# Altium schematic sheet My_robot_1.SchDoc
size A
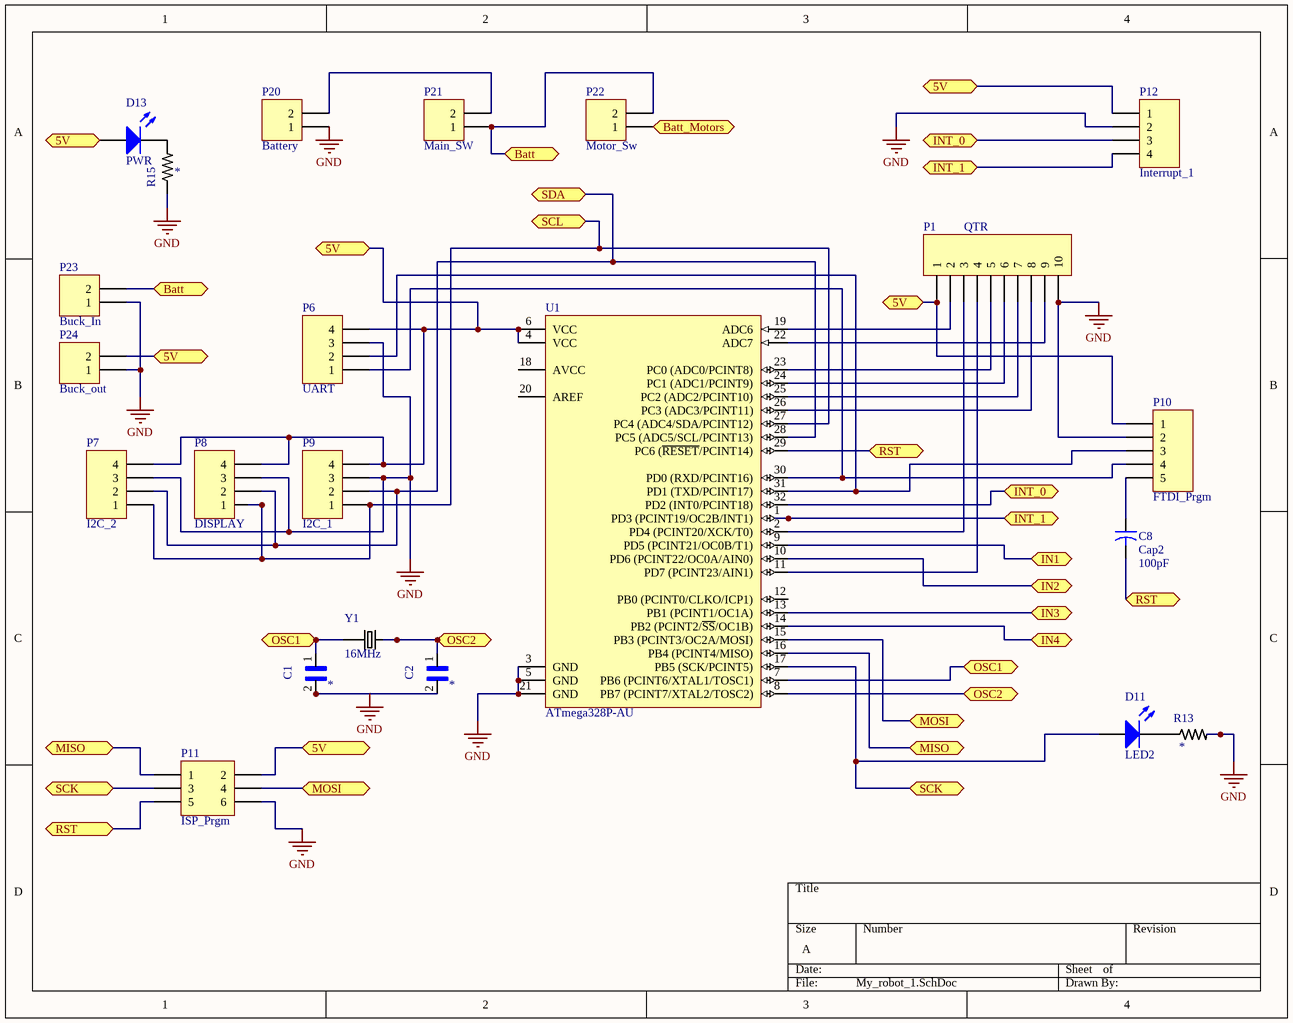
[diagram p0: My_robot_1.SchDoc]

## Parts
C1  Cap_0805  [CAP_0805]  (value not drawn)
C2  Cap_0805  [CAP_0805]  (value not drawn)
C8  Cap2  value 100pF  [CAPR5-4X5]
D11  LED2  [3.2X1.6X1.1]
D13  PWR  [3.2X1.6X1.1]
P1  QTR  [HDR1X10]
P6  UART  [HDR1X4]
P7  I2C_2  [HDR1X4]
P8  DISPLAY  [HDR1X4]
P9  I2C_1  [HDR1X4]
P10  FTDI_Prgm  [HDR1X5]
P11  ISP_Prgm  [HDR2X3]
P12  Interrupt_1  [HDR1X4]
P20  Battery  [HDR1X2]
P21  Main_SW  [HDR1X2]
P22  Motor_Sw  [HDR1X2]
P23  Buck_In  [HDR1X2]
P24  Buck_out  [HDR1X2]
R13  Res_0805  [Res_0805]  (value not drawn)
R15  Res_0805  [Res_0805]  (value not drawn)
U1  ATmega328P-AU  [32A_N]
Y1  16MHz  [XTAL_THT]

## Ports
5V, Batt, Batt_Motors, IN1, IN2, IN3, IN4, INT_0, INT_1, MISO, MOSI, OSC1, OSC2, RST, SCK, SCL, SDA

## Nets
GND: C1.2 C2.2 P1.10 P6.3 P7.3 P8.3 P9.3 P10.2 P11.6 P12.2 P20.1 P23.1 P24.1 R13.2 R15.1 U1.3(GND) U1.5(GND) U1.21(GND)
5V: D13.1(A) P1.1 P6.4 P7.4 P8.4 P9.4 P10.1 P11.2 P12.1 P24.2 U1.4(VCC) U1.6(VCC) ; port 5V
Batt: P21.1 P22.2 P23.2 ; port Batt
Batt_Motors: P22.1 ; port Batt_Motors
IN1: U1.9(PD5_(PCINT21/OC0B/T1)) ; port IN1
IN2: U1.10(PD6_(PCINT22/OC0A/AIN0)) ; port IN2
IN3: U1.13(PB1_(PCINT1/OC1A)) ; port IN3
IN4: U1.14(PB2_(PCINT2/~{SS}/OC1B)) ; port IN4
INT_0: P12.3 U1.32(PD2_(INT0/PCINT18)) ; port INT_0
INT_1: P12.4 U1.1(PD3_(PCINT19/OC2B/INT1)) ; port INT_1
MISO: P11.1 U1.16(PB4_(PCINT4/MISO)) ; port MISO
MOSI: P11.4 U1.15(PB3_(PCINT3/OC2A/MOSI)) ; port MOSI
OSC1: C1.1 U1.7(PB6_(PCINT6/XTAL1/TOSC1)) Y1.1 ; port OSC1
OSC2: C2.1 U1.8(PB7_(PCINT7/XTAL2/TOSC2)) Y1.2 ; port OSC2
RST: C8.2 P11.5 U1.29(PC6_(~{RESET}/PCINT14)) ; port RST
SCK: D11.1(A) P11.3 U1.17(PB5_(SCK/PCINT5)) ; port SCK
SCL: P7.1 P8.1 P9.1 U1.27(PC4_(ADC4/SDA/PCINT12)) ; port SCL
SDA: P7.2 P8.2 P9.2 U1.28(PC5_(ADC5/SCL/PCINT13)) ; port SDA
NetC8_1: C8.1 P10.5
NetD11_2: D11.2(K) R13.1
NetD13_2: D13.2(K) R15.2
NetP1_2: P1.2 U1.19(ADC6)
NetP1_3: P1.3 U1.2(PD4_(PCINT20/XCK/T0))
NetP1_4: P1.4 U1.11(PD7_(PCINT23/AIN1))
NetP1_5: P1.5 U1.23(PC0_(ADC0/PCINT8))
NetP1_6: P1.6 U1.24(PC1_(ADC1/PCINT9))
NetP1_7: P1.7 U1.25(PC2_(ADC2/PCINT10))
NetP1_8: P1.8 U1.26(PC3_(ADC3/PCINT11))
NetP1_9: P1.9 U1.22(ADC7)
NetP6_1: P6.1 P10.4 U1.30(PD0_(RXD/PCINT16))
NetP6_2: P6.2 P10.3 U1.31(PD1_(TXD/PCINT17))
NetP20_2: P20.2 P21.2

Not connected (* = marked no-connect by the designer): U1 12(PB0_(PCINT0/CLKO/ICP1)) 18(AVCC) 20(AREF)

## Library data of the parts
C1 C2 = Cap_0805: Cap Ceramic 10uF 10V X5R 10% SMD 0805 85Â°C Embossed Plastic T/R; MF: Samsung Electro-Mechanics; MP: CL21A106KPFNNWE; Price: None; SnapEDA_Link: https://www.snapeda.com/parts/CL21A106KPFNNWE/Samsung%20Electro-Mechanics/view-part/?ref=snap; Package: 0805 Samsung; Availability: Unavailable; Value: *
C8 = Cap2: Capacitor; Published: 23-Sep-2002; PackageReference: CAPR5-4X5; Publisher: Altium Limited; PackageDescription: Capacitor; 2 Leads
D11 D13 = LED2: Typical RED, GREEN, YELLOW, AMBER GaAs LED; Published: 8-Jun-2000; LatestRevisionDate: 17-Jul-2002; LatestRevisionNote: Re-released for DXP Platform.; PackageVersion: Feb-2002; PackageReference: 3.2X1.6X1.1; Publisher: Altium Limited; PackageDescription: SM LED; 2 Flat Leads
P1 = Header 10: Header, 10-Pin; LatestRevisionDate: 17-Jul-2002; LatestRevisionNote: Re-released for DXP Platform.; Publisher: Altium Limited
P6-P9 P12 = Header 4: Header, 4-Pin; LatestRevisionDate: 17-Jul-2002; LatestRevisionNote: Re-released for DXP Platform.; Publisher: Altium Limited
P10 = Header 5: Header, 5-Pin; LatestRevisionDate: 17-Jul-2002; LatestRevisionNote: Re-released for DXP Platform.; Publisher: Altium Limited
P11 = Header 3X2: Header, 3-Pin, Dual row; LatestRevisionDate: 17-Jul-2002; LatestRevisionNote: Re-released for DXP Platform.; Publisher: Altium Limited
P20-P24 = Header 2: Header, 2-Pin; LatestRevisionDate: 17-Jul-2002; LatestRevisionNote: Re-released for DXP Platform.; Publisher: Altium Limited
R13 R15 = Res_0805: Res Thick Film 0805 392 Ohm 1% 1/3W Â±100ppm/Â°C Molded SMD SMD T/R; MP: CRGH0805F392R; MF: TE Connectivity; TE_purchase_URL: https://www.te.com/usa-en/product-5-1879509-5.html?te_bu=Cor&te_type=disp&te_campaign=seda_glo_cor-seda-global-disp-prtnr-fy19-seda-model-bom-cta_sma-317_1&elqCampaignId=32493; Availability: Unavailable; SnapEDA_Link: https://www.snapeda.com/parts/CRGH0805F392R/TE%20Connectivity%20Passive%20Product/view-part/?ref=snap; Price: None; Package: 0805 TE Connectivity; Value: *
U1 = ATmega328P-AU: 8-bit AVR Microcontroller, 32KB Flash, 1KB EEPROM, 2KB SRAM, 32-pin TQFP, Industrial Grade (-40°C to 85°C); Published: 1-Apr-2010; DatasheetVersion: revA, Jan-2010; PackageVersion: revB, Oct-2001; PackageReference: 32A; Publisher: Altium Limited; PackageDescription: 32-Lead, 7x7x1.0 mm Body, 0.8mm Lead Pitch, Thin Profile Plastic Quad Flat Package (TQFP); Supplier 1: Digi-Key; Supplier Part Number 1: ATMEGA328P-AU-ND; Supplier 2: Farnell; Supplier Part Number 2: 1715486; Supplier 3: Mouser; Supplier Part Number 3: 556-ATMEGA328P-AU; Code_JEDEC: MS-026-ABA; ComponentLink1Description: Manufacturer Link; ComponentLink1URL: http://www.atmel.com/products/avr/default.asp?; ComponentLink2Description: ATmega48A/48PA/88A/88PA/168A/168PA/328/328P Datasheet; ComponentLink2URL: http://www.atmel.com/dyn/resources/prod_documents/8271.pdf; ComponentLink3Description: ATmega48A/48PA/88A/88PA/168A/168PA/328/328P Summary; ComponentLink3URL: http://www.atmel.com/dyn/resources/prod_documents/8271S.pdf; ComponentLink4Description: Atmel.com Home; ComponentLink4URL: http://www.atmel.com
Y1 = Xtal_THT: Crystal 3.93216MHz 17pF 2-Pin HC-49/U; MF: ECS Inc.; MP: ECS-39-17-1X; Availability: Unavailable; Price: None; SnapEDA_Link: https://www.snapeda.com/parts/ECS-39-17-1X/ECS%20Inc./view-part/?ref=snap; Package: HC49/U ECS International; Value: *